# Altium schematic sheet Input_Output.SchDoc
size 420 x 297 mm; SheetNumber: 2; SheetTotal: 2
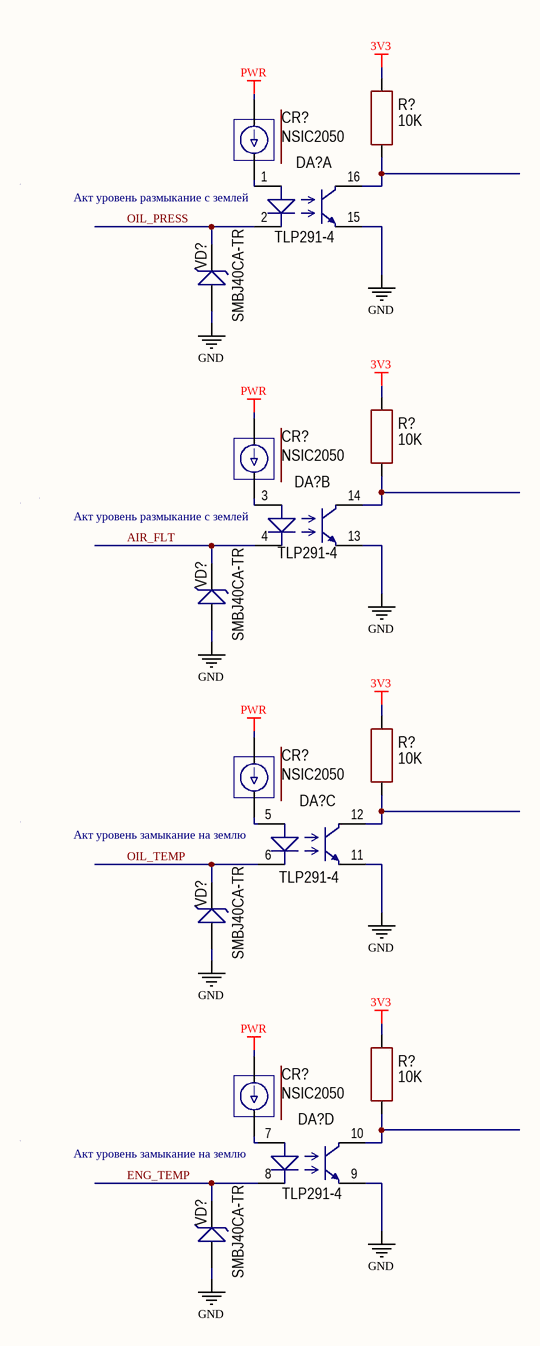
[diagram p0: Input_Output.SchDoc]

## Parts
(Parts that share a designator on the sheet are numbered #1, #2 ... from top to bottom, then left to right.)
CR?#1  value NSIC2050  [SMB1]  (hidden comment: NSIC20XX)
CR?#2  value NSIC2050  [SMB1]  (hidden comment: NSIC20XX)
CR?#3  value NSIC2050  [SMB1]  (hidden comment: NSIC20XX)
CR?#4  value NSIC2050  [SMB1]  (hidden comment: NSIC20XX)
DA?#1  TLP291-4  [SOP16]  (part A of 4)
DA?#2  TLP291-4  [SOP16]  (part B of 4)
DA?#3  TLP291-4  [SOP16]  (part C of 4)
DA?#4  TLP291-4  [SOP16]  (part D of 4)
R?#1  value 10K  [RES: 1206]
R?#2  value 10K  [RES: 1206]
R?#3  value 10K  [RES: 1206]
R?#4  value 10K  [RES: 1206]
VD?#1  value SMBJ40CA-TR  [SMB]  (hidden comment: suppressor)
VD?#2  value SMBJ40CA-TR  [SMB]  (hidden comment: suppressor)
VD?#3  value SMBJ40CA-TR  [SMB]  (hidden comment: suppressor)
VD?#4  value SMBJ40CA-TR  [SMB]  (hidden comment: suppressor)

## Nets
3V3: R?#1.2 R?#2.2 R?#3.2 R?#4.2
GND: DA?#1.15 DA?#2.13 DA?#3.11 DA?#4.9 VD?#1.2 VD?#2.2 VD?#3.2 VD?#4.2
PWR: CR?#1.A CR?#2.A CR?#3.A CR?#4.A
AIR_FLT: DA?#2.4 VD?#2.1
ENG_TEMP: DA?#4.8 VD?#4.1
OIL_PRESS: DA?#1.2 VD?#1.1
OIL_TEMP: DA?#3.6 VD?#3.1
NetCR?#1_K: CR?#1.K DA?#1.1
NetCR?#2_K: CR?#2.K DA?#2.3
NetCR?#3_K: CR?#3.K DA?#3.5
NetCR?#4_K: CR?#4.K DA?#4.7
NetDA?#1_16: DA?#1.16 R?#1.1
NetDA?#2_14: DA?#2.14 R?#2.1
NetDA?#3_12: DA?#3.12 R?#3.1
NetDA?#4_10: DA?#4.10 R?#4.1

## Notes on the sheet
- (near DA?#1) Акт уровень размыкание с землей
- (near DA?#2) Акт уровень размыкание с землей
- Акт уровень замыкание на землю
- Подп. и дата
- Инв. № дубл.
- Взам. инв. №
- Инв. № подл.
- Изм.
- Лист
- № докум.
- Подп.
- Дата
- 2.106-A3
- Копировал
- Формат А3

## Library data of the parts
CR?#1-CR?#4 = NSIC20XX: pin to pad: A>2 K>1
R?#1-R?#4 = Resistor_1206: Manufacturer: Yageo; PartNumber: RC1206JR-07100RL; ValueManufacturerPartNumber: Resistor film, 10K, ±5%, 1206, 0.25W, -55...+125°C; TypeResistor: Resistor film; Power: 0.25W; Tolerance: ±5%; Package: 1206; HelpURL: https://www.digikey.com/product-detail/en/yageo/RC1206JR-07100RL/311-100ERCT-ND/732153; Temperature: -55...+125°C
DA?#1-DA?#4 = TLP291-4: Value: TLP291-4